# EAGLE design FTDIMicro (EAGLE 7.2.0)
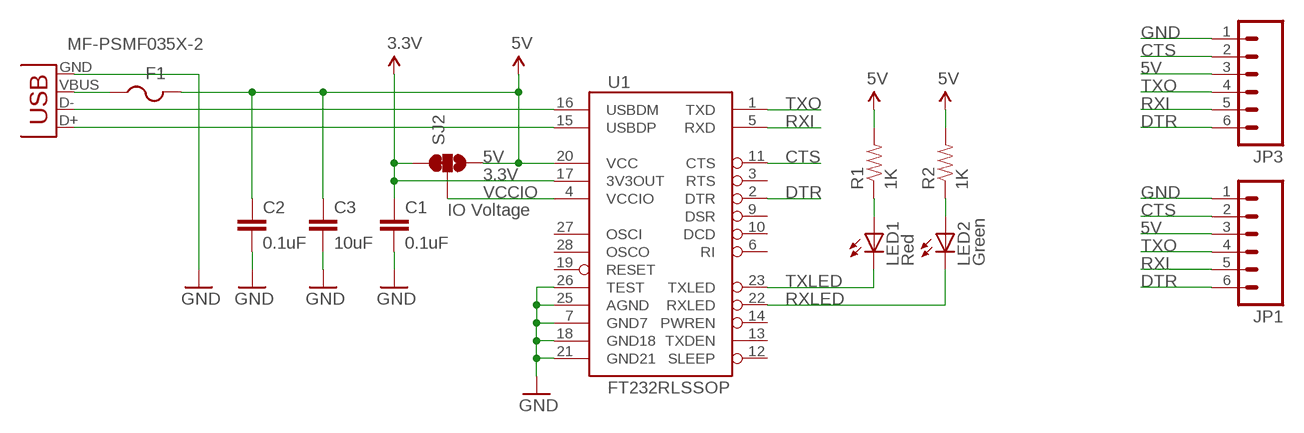
[diagram p0: schematic, sheet 1]

## Parts
C1  0.1uF  CAP0603-CAP  [0603-CAP]
C2  0.1uF  CAP0603-CAP  [0603-CAP]
C3  10uF  CAP0603-CAP  [0603-CAP]
F1  MF-PSMF035X-2  PTCFUSE-1206  [R1206]
JP1  M06SMD-FEMALE-V2  [1X06-SMD-FEMALE-V2]
JP3  M06SMD-FEMALE-V2  [1X06-SMD-FEMALE-V2]
LED1  Red  LED0603  [LED-0603]
LED2  Green  LED0603  [LED-0603]
R1  1K  RESISTOR0603-RES  [0603-RES]
R2  1K  RESISTOR0603-RES  [0603-RES]
SJ2  SOLDERJUMPER_2WAYS  [SJ_3]
U1  FT232RLSSOP  [SSOP28DB]
X1  USB-MICROB  [USB-MICROB]

## Nets
3.3V [power]: C1.1 SJ2.1 U1.17(3V3OUT)
5V: C2.1 C3.1 F1.2 JP1.3 JP3.3 R1.2 R2.2 SJ2.3 U1.20(VCC)
CTS: JP1.2 JP3.2 U1.11(CTS)
DTR: JP1.6 JP3.6 U1.2(DTR)
GND [power]: C1.2 C2.2 C3.2 JP1.1 JP3.1 U1.7(GND7) U1.18(GND18) U1.21(GND21) U1.25(AGND) U1.26(TEST) X1.GND
N$1: LED1.A R1.1
N$2: LED2.A R2.1
N$3: F1.1 X1.VBUS
RXI: JP1.5 JP3.5 U1.5(RXD)
RXLED: LED2.C U1.22(RXLED)
TXLED: LED1.C U1.23(TXLED)
TXO: JP1.4 JP3.4 U1.1(TXD)
USB_D+: U1.15(USBDP) X1.D+
USB_D-: U1.16(USBDM) X1.D-
VCCIO: SJ2.2 U1.4(VCCIO)
Unconnected: U1.3(RTS) U1.6(RI) U1.9(DSR) U1.10(DCD) U1.12(SLEEP) U1.13(TXDEN) U1.14(PWREN) U1.19(RESET) U1.27(OSCI) U1.28(OSCO)

## Notes on the sheet
- IO Voltage

## Library data of the parts
C1-C3 = SparkFun:CAP: Capacitor Standard 0603 ceramic capacitor, and 0.1" leaded capacitor.
F1 = adafruit:PTCFUSE: PTC fuses, resettable thermistors
JP1 JP3 = SparkFun:M06: Header 6 Standard 6-pin 0.1" header. Use with straight break away headers (SKU : PRT-00116), right angle break away headers (PRT-00553), swiss pins (PRT-00743), machine pins (PRT-00117), and female headers (PRT-00115). Molex polarized connector foot print use with SKU : PRT-08094 with associated crimp pins and housings. NOTES ON THE VARIANTS LOCK and LOCK_LONGPADS... This footprint was designed to help hold the alignment of a through-hole component (i.e. 6-pin header) while soldering it into place. You may notice that each hole has been shifted either up or down by 0.005 of an inch from it's more standard position (which is a perfectly straight line). This slight alteration caused the pins (the squares in the middle) to touch the edges of the holes. Because they are alternating, it causes a "brace" to hold the component in place. 0.005 has proven to be the perfect amount of "off-center" position when using our standard breakaway headers. Although looks a little odd when you look at the bare footprint, once you have a header in there, the alteration is very hard to notice. Also, if you push a header all the way into place, it is covered up entirely on the bottom side. This idea of altering the position of holes to aid alignment will be further integrated into the Sparkfun Library for other footprints. It can help hold any component with 3 or more connection pins.
LED1 LED2 = SparkFun:LED: LEDs Standard schematic elements and footprints for 5mm, 3mm, 1206, and 0603 sized LEDs. 5mm - Spark Fun Electronics SKU : COM-00529 (and others)
R1 R2 = SparkFun:RESISTOR: Resistor Basic schematic elements and footprints for 0603, 1206, and PTH resistors.
SJ2 = SparkFun:SOLDERJUMPER_2WAY: Solder Jumper 2 way solder jumper
U1 = SparkFun:FT232RL: USB UART FT232RL 4th Generation USB UART (USB <-> Serial) Controller. Spark Fun Electronics SKU : COM-00650
X1 = SparkFun:USB: USB Connectors USB-B-PTH is fully proven SKU : PRT-00139 USB-miniB is fully proven SKU : PRT-00587 USB-A-PCB is untested. USB-A-H is throughly reviewed, but untested. Spark Fun Electronics SKU : PRT-00437 USB-B-SMT is throughly reviewed, but untested. Needs silkscreen touching up. USB-A-S has not been used/tested USB-MB-H has not been used/tested

## Net classes
0 default: width 0.203 mm
1 power: width 0.254 mm

## Board
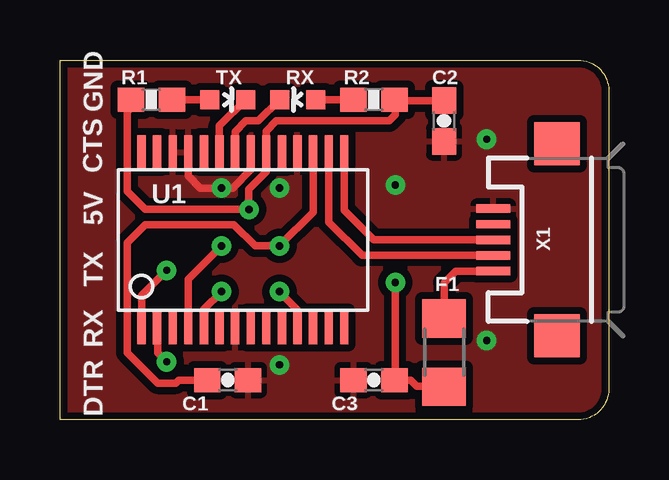
[diagram p1: board, top side]
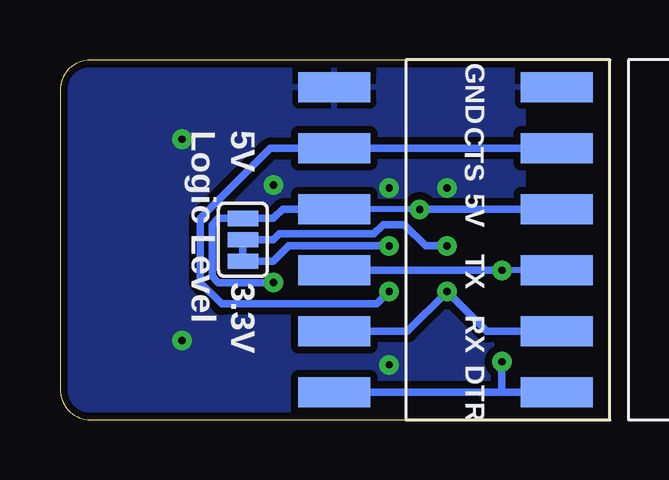
[diagram p2: board, bottom side, seen from below]

Size 22.86 x 14.99 mm. Coordinates in mm from the lower left corner, seen from the top.
Outline: 0,0 0,14.99 21.59,14.99 arc-90 22.86,13.72 22.86,1.27 arc-90 21.59,0 0,0
Copper layers (1*16): Top 0.035mm / dielectric 1.5mm / Bottom 0.035mm
Design rules "default": minimum track width 8mil, minimum drill 20mil, track to track 8mil, track to pad 8mil, pad to pad 8mil, via to via 8mil, smd to smd 8mil, copper to edge 8mil, drill to drill 8mil, minimum pad ring 12mil, minimum via ring 10mil, stop-mask expansion 4mil, vias tented up to drill 20mil, thermal gap 10mil

### Footprints (pad centres in the part's own frame; a part is rotated, then mirrored left to right if it is on the bottom)
0603-CAP = smd 1.1 x 1: 1 -0.85,0; 2 0.85,0
R1206 = smd 1.6 x 1.803: 1 -1.422,0; 2 1.422,0
1X06-SMD-FEMALE-V2 = smd 1.25 x 3: 1 6.35,3.425; 2 3.81,3.425; 3 1.27,3.425; 4 -1.27,3.425; 5 -3.81,3.425; 6 -6.35,3.425
LED-0603 = smd 0.8 x 0.8: A 0,-0.75; C 0,0.75
0603-RES = smd 1.1 x 1: 1 -0.85,0; 2 0.85,0
SJ_3 = smd 0.635 x 1.27: 1 -0.889,0; 2 0,0; 3 0.889,0
SSOP28DB = smd 0.348 x 1.397: 1 -4.225,-3.656; 2 -3.575,-3.656; 3 -2.925,-3.656; 4 -2.275,-3.656; 5 -1.625,-3.656; 6 -0.975,-3.656; 7 -0.325,-3.656; 8 0.325,-3.656; 9 0.975,-3.656; 10 1.625,-3.656; 11 2.275,-3.656; 12 2.925,-3.656; 13 3.575,-3.656; 14 4.225,-3.656; 15 4.225,3.656; 16 3.575,3.656; 17 2.925,3.656; 18 2.275,3.656; 19 1.625,3.656; 20 0.975,3.656; 21 0.325,3.656; 22 -0.325,3.656; 23 -0.975,3.656; 24 -1.625,3.656; 25 -2.275,3.656; 26 -2.925,3.656; 27 -3.575,3.656; 28 -4.225,3.656
USB-MICROB = smd 0.35 x 1.4: D+ 0,2.65; D- -0.65,2.65; GND 1.3,2.65; ID 0.65,2.65; VBUS -1.3,2.65 | smd 1.8 x 1.9: MT1 -4,0; MT2 4,0

### Placement (x,y rotation side)
C1  6.99,1.65 0 top
C2  16,12.45 270 top
C3  13.08,1.65 180 top
F1  16,2.79 270 top
JP1  8,7.49 90 bottom
JP3  -1.27,7.49 90 bottom
LED1  6.99,13.33 270 top
LED2  9.91,13.33 90 top
R1  3.81,13.33 180 top
R2  13.08,13.33 0 top
SJ2  15.24,7.49 90 bottom
U1  7.62,7.49 0 top
X1  20.7,7.49 90 top

### Tracks (layer width: path | path; a pad name or v marks a point on that pad's centre or on a via)
3.3V  (via drill 0.3)
  Top 0.305: C1.1 4.95,1.65 4.83,1.52 4.06,1.52 2.79,2.79 2.79,7.37 3.56,8.13 7.24,8.13 8.13,7.24 v9.14,7.24 10.54,8.64 U1.17
  Bottom 0.305: v9.14,7.24 13.34,7.24 13.97,6.6 SJ2.1
5V  (via drill 0.3)
  Top 0.305: R1.2 3.16,13.19 2.79,12.83 2.79,9.52 3.56,8.76 v7.87,8.76 7.87,9.6 8.6,10.32 U1.20 8.6,12.02 9.02,12.45 13.72,12.45 13.97,12.7 13.97,13.3 | v13.97,5.71 13.97,1.69 C3.1 14.61,1.65 14.86,1.4 15.98,1.4 F1.2 | 13.97,13.3 R2.2 | 13.97,13.3 C2.1
  Bottom 0.254: v7.87,8.76 JP1.3
  Bottom 0.305: v13.97,5.71 16.26,5.71 16.51,5.97 16.51,8.13 16.26,8.38 SJ2.3 13.97,8.38 13.59,8.76 JP1.3 | JP3.3 v7.87,8.76
CTS  (via drill 0.3)
  Top 0.305: U1.11 9.89,4.58 v9.14,5.33
  Bottom 0.305: v9.14,5.33 9.65,4.83 16.13,4.83 17.02,5.71 17.02,8.38 14.1,11.3 JP1.2 JP3.2
DTR  (via drill 0.3)
  Top 0.254: U1.2 4.06,3.86
  Top 0.305: 4.06,3.86 4.06,2.79 v4.45,2.41
  Bottom 0.305: 4.45,1.14 JP1.6 | v4.45,2.41 4.45,1.14 | JP3.6 4.45,1.14
GND  (via drill 0.3)
  Top 0.305: U1.21 7.95,10.41 7.19,9.65 v6.73,9.65 5.84,9.65 5.33,10.16 5.33,11.14 U1.25
  other vias: 17.78,3.3 17.78,11.68 13.97,9.78 9.14,2.29 9.14,9.65
  pour Bottom (isolate 0.305): 3.56,-0.03 3.56,15.02 21.59,15.02 arc-90 22.86,13.75 22.86,1.24 arc-90 21.59,-0.03
  pour Top (isolate 0.305): 0,-0.03 0,15.02 21.59,15.02 arc-90 22.86,13.75 22.86,1.24 arc-90 21.59,-0.03
N$1
  Top 0.305: R1.1 LED1.A
N$2
  Top 0.305: LED2.A R2.1
N$3
  Top 0.305: X1.VBUS 16.48,6.19 16,5.71 F1.1
RXI  (via drill 0.3)
  Top 0.305: U1.5 6,4.6 v6.73,5.33
  Bottom 0.305: JP3.5 5.08,3.68 v6.73,5.33 8.38,3.68 JP1.5
RXLED
  Top 0.305: U1.22 7.29,11.99 7.75,12.45 8.27,12.45 LED2.C
TXLED
  Top 0.305: U1.23 6.64,12.24 LED1.C
TXO  (via drill 0.3)
  Top 0.254: 3.4,5.11 3.4,5.18
  Top 0.305: 3.4,5.11 U1.1 | 3.4,5.18 v4.45,6.22
  Bottom 0.254: JP3.4 v4.45,6.22
  Bottom 0.305: v4.45,6.22 JP1.4
USB_D+
  Top 0.305: U1.15 11.85,8.73 13.08,7.49 X1.D+
USB_D-
  Top 0.305: U1.16 11.2,8.24 12.59,6.84 X1.D-
VCCIO  (via drill 0.3)
  Top 0.254: 5.33,3.85 U1.4
  Top 0.305: v6.73,7.24 5.33,5.84 5.33,3.85
  Bottom 0.254: SJ2.2 15.24,6.6
  Bottom 0.305: 15.24,6.6 SJ2.2 13.97,7.49 13.72,7.75 9.78,7.75 9.4,8.13 8.51,8.13 7.62,7.24 v6.73,7.24

### Text on the board
tPlace: TX | RX | GND | CTS | 5V | TX | RX | DTR
bPlace: GND | CTS | 5V | TX | RX | DTR
bNames: 5V | Logic Level | 3.3V
_bsilk: FTDI Micro v1 | TaaraLabs.eu/fu1